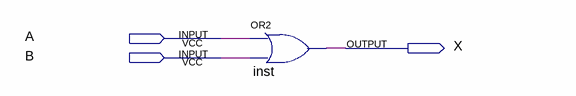
[diagram p0: schematic sheet]
// Quartus schematic test2.bdf as structural Verilog: 1 symbols, 3 pins
module test2 (
  input  A,
  input  B,
  output X
);

  or inst (X, A, B);
endmodule
